# Altium schematic sheet Sheet2.SchDoc
size A4
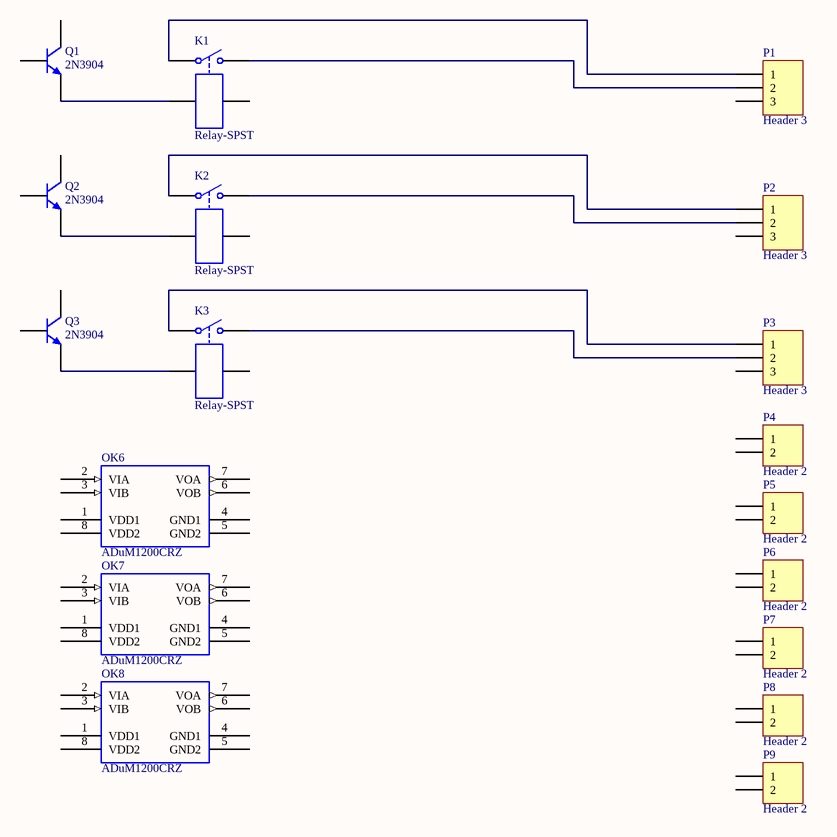
[diagram p0: Sheet2.SchDoc]

## Parts
K1  Relay-SPST  [DIP-P4]
K2  Relay-SPST  [DIP-P4]
K3  Relay-SPST  [DIP-P4]
OK6  ADuM1200CRZ
OK7  ADuM1200CRZ
OK8  ADuM1200CRZ
P1  Header 3  [HDR1X3]
P2  Header 3  [HDR1X3]
P3  Header 3  [HDR1X3]
P4  Header 2  [HDR1X2]
P5  Header 2  [HDR1X2]
P6  Header 2  [HDR1X2]
P7  Header 2  [HDR1X2]
P8  Header 2  [HDR1X2]
P9  Header 2  [HDR1X2]
Q1  2N3904  [BCY-W3/E4]
Q2  2N3904  [BCY-W3/E4]
Q3  2N3904  [BCY-W3/E4]

## Nets
NetK1_1: K1.1 P1.1
NetK1_2: K1.2 P1.2
NetK1_3: K1.3 Q1.1(E)
NetK2_1: K2.1 P2.1
NetK2_2: K2.2 P2.2
NetK2_3: K2.3 Q2.1(E)
NetK3_1: K3.1 P3.1
NetK3_2: K3.2 P3.2
NetK3_3: K3.3 Q3.1(E)

Not connected (* = marked no-connect by the designer): K1 4; K2 4; K3 4; OK6 1(VDD1) 2(VIA) 3(VIB) 4(GND1) 5(GND2) 6(VOB) 7(VOA) 8(VDD2); OK7 1(VDD1) 2(VIA) 3(VIB) 4(GND1) 5(GND2) 6(VOB) 7(VOA) 8(VDD2); OK8 1(VDD1) 2(VIA) 3(VIB) 4(GND1) 5(GND2) 6(VOB) 7(VOA) 8(VDD2); P1 3; P2 3; P3 3; P4 1 2; P5 1 2; P6 1 2; P7 1 2; P8 1 2; P9 1 2; Q1 2(B) 3(C); Q2 2(B) 3(C); Q3 2(B) 3(C)

## Library data of the parts
K1-K3 = Relay-SPST: Single-Pole Single-Throw Relay; Published: 24-Mar-1999; LatestRevisionDate: 17-Jul-2002; LatestRevisionNote: Re-released for DXP Platform.; PackageReference: MODULE4; Publisher: Altium Limited
P1-P3 = Header 3: Header, 3-Pin; LatestRevisionDate: 17-Jul-2002; LatestRevisionNote: Re-released for DXP Platform.; Publisher: Altium Limited
P4-P9 = Header 2: Header, 2-Pin; LatestRevisionDate: 17-Jul-2002; LatestRevisionNote: Re-released for DXP Platform.; Publisher: Altium Limited
Q1-Q3 = 2N3904: NPN General Purpose Amplifier; Published: 8-Jun-2000; LatestRevisionDate: 15-Jan-2003; LatestRevisionNote: PCB Footprint 'BCY-W3/D4.7' replaced; DatasheetVersion: 1997; PackageVersion: Sep-1998; PackageReference: TO-92A; Publisher: Altium Limited; Code_JEDEC: TO-92A; ComponentLink1Description: Manufacturer Link; ComponentLink1URL: http://www.fairchildsemi.com/; ComponentLink2Description: Datasheet; ComponentLink2URL: http://www.fairchildsemi.com/ds/2N%2F2N3904.pdf
OK6-OK8 = ADuM1200CRZ: BodyName: *; Instance: *; PartName: *; PLACEMENT_REGION: *; CompValue: *; Right: *; Bottom: *; SymName: *; RefLocation: *; BoardLocation: *; SlotXofY: *